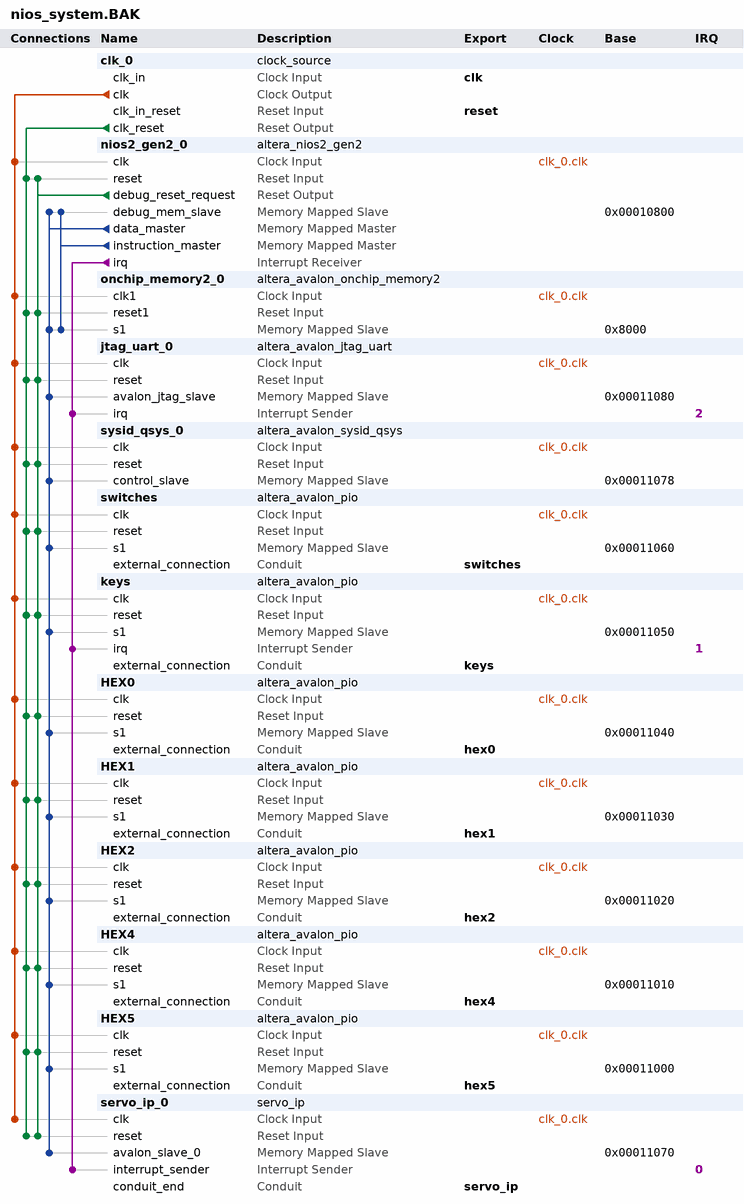
[diagram p0: system contents]
# Platform Designer (Qsys) system nios_system.BAK, Cyclone V 5CSEMA5F31C6
# Parameters at their usual value, and those the tool derives, are not listed.
package require -exact qsys 18.1
create_system nios_system.BAK
set_project_property DEVICE_FAMILY {Cyclone V}
set_project_property DEVICE 5CSEMA5F31C6

add_instance clk_0 clock_source 18.1
set_instance_parameter_value clk_0 clockFrequency 50000000

add_instance nios2_gen2_0 altera_nios2_gen2 18.1
set_instance_parameter_value nios2_gen2_0 dcache_size 2048
set_instance_parameter_value nios2_gen2_0 exceptionSlave onchip_memory2_0.s1
set_instance_parameter_value nios2_gen2_0 icache_size 4096
set_instance_parameter_value nios2_gen2_0 impl Tiny
set_instance_parameter_value nios2_gen2_0 resetSlave onchip_memory2_0.s1

add_instance onchip_memory2_0 altera_avalon_onchip_memory2 18.1
set_instance_parameter_value onchip_memory2_0 dataWidth 32
set_instance_parameter_value onchip_memory2_0 dualPort false
set_instance_parameter_value onchip_memory2_0 initMemContent true
set_instance_parameter_value onchip_memory2_0 initializationFileName onchip_mem.hex
set_instance_parameter_value onchip_memory2_0 memorySize 32768

add_instance jtag_uart_0 altera_avalon_jtag_uart 18.1
set_instance_parameter_value jtag_uart_0 simInteractiveOptions NO_INTERACTIVE_WINDOWS

add_instance sysid_qsys_0 altera_avalon_sysid_qsys 18.1
set_instance_parameter_value sysid_qsys_0 id 257

add_instance switches altera_avalon_pio 18.1
set_instance_parameter_value switches direction Input
set_instance_parameter_value switches width 8

add_instance keys altera_avalon_pio 18.1
set_instance_parameter_value keys captureEdge true
set_instance_parameter_value keys direction Input
set_instance_parameter_value keys edgeType FALLING
set_instance_parameter_value keys generateIRQ true
set_instance_parameter_value keys irqType EDGE
set_instance_parameter_value keys width 4

add_instance HEX0 altera_avalon_pio 18.1
set_instance_parameter_value HEX0 direction Output
set_instance_parameter_value HEX0 width 7

add_instance HEX1 altera_avalon_pio 18.1
set_instance_parameter_value HEX1 direction Output
set_instance_parameter_value HEX1 width 7

add_instance HEX2 altera_avalon_pio 18.1
set_instance_parameter_value HEX2 direction Output
set_instance_parameter_value HEX2 width 7

add_instance HEX4 altera_avalon_pio 18.1
set_instance_parameter_value HEX4 direction Output
set_instance_parameter_value HEX4 width 7

add_instance HEX5 altera_avalon_pio 18.1
set_instance_parameter_value HEX5 direction Output
set_instance_parameter_value HEX5 width 7

add_instance servo_ip_0 servo_ip 1.0
set_instance_parameter_value servo_ip_0 max_angle 00000000000000011000011010100000
set_instance_parameter_value servo_ip_0 min_angle 00000000000000001100001101010000

# connections
add_connection clk_0.clk HEX0.clk clock
add_connection clk_0.clk HEX1.clk clock
add_connection clk_0.clk HEX2.clk clock
add_connection clk_0.clk HEX4.clk clock
add_connection clk_0.clk HEX5.clk clock
add_connection clk_0.clk jtag_uart_0.clk clock
add_connection clk_0.clk keys.clk clock
add_connection clk_0.clk nios2_gen2_0.clk clock
add_connection clk_0.clk onchip_memory2_0.clk1 clock
add_connection clk_0.clk servo_ip_0.clk clock
add_connection clk_0.clk switches.clk clock
add_connection clk_0.clk sysid_qsys_0.clk clock
add_connection clk_0.clk_reset HEX0.reset reset
add_connection clk_0.clk_reset HEX1.reset reset
add_connection clk_0.clk_reset HEX2.reset reset
add_connection clk_0.clk_reset HEX4.reset reset
add_connection clk_0.clk_reset HEX5.reset reset
add_connection clk_0.clk_reset jtag_uart_0.reset reset
add_connection clk_0.clk_reset keys.reset reset
add_connection clk_0.clk_reset nios2_gen2_0.reset reset
add_connection clk_0.clk_reset onchip_memory2_0.reset1 reset
add_connection clk_0.clk_reset servo_ip_0.reset reset
add_connection clk_0.clk_reset switches.reset reset
add_connection clk_0.clk_reset sysid_qsys_0.reset reset
add_connection nios2_gen2_0.debug_reset_request HEX0.reset reset
add_connection nios2_gen2_0.debug_reset_request HEX1.reset reset
add_connection nios2_gen2_0.debug_reset_request HEX2.reset reset
add_connection nios2_gen2_0.debug_reset_request HEX4.reset reset
add_connection nios2_gen2_0.debug_reset_request HEX5.reset reset
add_connection nios2_gen2_0.debug_reset_request jtag_uart_0.reset reset
add_connection nios2_gen2_0.debug_reset_request keys.reset reset
add_connection nios2_gen2_0.debug_reset_request nios2_gen2_0.reset reset
add_connection nios2_gen2_0.debug_reset_request onchip_memory2_0.reset1 reset
add_connection nios2_gen2_0.debug_reset_request servo_ip_0.reset reset
add_connection nios2_gen2_0.debug_reset_request switches.reset reset
add_connection nios2_gen2_0.debug_reset_request sysid_qsys_0.reset reset
add_connection nios2_gen2_0.data_master HEX0.s1 avalon
set_connection_parameter_value nios2_gen2_0.data_master/HEX0.s1 baseAddress 0x00011040
add_connection nios2_gen2_0.data_master HEX1.s1 avalon
set_connection_parameter_value nios2_gen2_0.data_master/HEX1.s1 baseAddress 0x00011030
add_connection nios2_gen2_0.data_master HEX2.s1 avalon
set_connection_parameter_value nios2_gen2_0.data_master/HEX2.s1 baseAddress 0x00011020
add_connection nios2_gen2_0.data_master HEX4.s1 avalon
set_connection_parameter_value nios2_gen2_0.data_master/HEX4.s1 baseAddress 0x00011010
add_connection nios2_gen2_0.data_master HEX5.s1 avalon
set_connection_parameter_value nios2_gen2_0.data_master/HEX5.s1 baseAddress 0x00011000
add_connection nios2_gen2_0.data_master jtag_uart_0.avalon_jtag_slave avalon
set_connection_parameter_value nios2_gen2_0.data_master/jtag_uart_0.avalon_jtag_slave baseAddress 0x00011080
add_connection nios2_gen2_0.data_master keys.s1 avalon
set_connection_parameter_value nios2_gen2_0.data_master/keys.s1 baseAddress 0x00011050
add_connection nios2_gen2_0.data_master nios2_gen2_0.debug_mem_slave avalon
set_connection_parameter_value nios2_gen2_0.data_master/nios2_gen2_0.debug_mem_slave baseAddress 0x00010800
add_connection nios2_gen2_0.data_master onchip_memory2_0.s1 avalon
set_connection_parameter_value nios2_gen2_0.data_master/onchip_memory2_0.s1 baseAddress 0x8000
add_connection nios2_gen2_0.data_master servo_ip_0.avalon_slave_0 avalon
set_connection_parameter_value nios2_gen2_0.data_master/servo_ip_0.avalon_slave_0 baseAddress 0x00011070
add_connection nios2_gen2_0.data_master switches.s1 avalon
set_connection_parameter_value nios2_gen2_0.data_master/switches.s1 baseAddress 0x00011060
add_connection nios2_gen2_0.data_master sysid_qsys_0.control_slave avalon
set_connection_parameter_value nios2_gen2_0.data_master/sysid_qsys_0.control_slave baseAddress 0x00011078
add_connection nios2_gen2_0.instruction_master nios2_gen2_0.debug_mem_slave avalon
set_connection_parameter_value nios2_gen2_0.instruction_master/nios2_gen2_0.debug_mem_slave baseAddress 0x00010800
add_connection nios2_gen2_0.instruction_master onchip_memory2_0.s1 avalon
set_connection_parameter_value nios2_gen2_0.instruction_master/onchip_memory2_0.s1 baseAddress 0x8000
add_connection nios2_gen2_0.irq jtag_uart_0.irq interrupt
set_connection_parameter_value nios2_gen2_0.irq/jtag_uart_0.irq irqNumber 2
add_connection nios2_gen2_0.irq keys.irq interrupt
set_connection_parameter_value nios2_gen2_0.irq/keys.irq irqNumber 1
add_connection nios2_gen2_0.irq servo_ip_0.interrupt_sender interrupt
set_connection_parameter_value nios2_gen2_0.irq/servo_ip_0.interrupt_sender irqNumber 0

# exported interfaces
add_interface clk clock sink
set_interface_property clk EXPORT_OF clk_0.clk_in
add_interface hex0 conduit end
set_interface_property hex0 EXPORT_OF HEX0.external_connection
add_interface hex1 conduit end
set_interface_property hex1 EXPORT_OF HEX1.external_connection
add_interface hex2 conduit end
set_interface_property hex2 EXPORT_OF HEX2.external_connection
add_interface hex4 conduit end
set_interface_property hex4 EXPORT_OF HEX4.external_connection
add_interface hex5 conduit end
set_interface_property hex5 EXPORT_OF HEX5.external_connection
add_interface keys conduit end
set_interface_property keys EXPORT_OF keys.external_connection
add_interface reset reset sink
set_interface_property reset EXPORT_OF clk_0.clk_in_reset
add_interface servo_ip conduit end
set_interface_property servo_ip EXPORT_OF servo_ip_0.conduit_end
add_interface switches conduit end
set_interface_property switches EXPORT_OF switches.external_connection

set_interconnect_requirement {$system} qsys_mm.clockCrossingAdapter HANDSHAKE
set_interconnect_requirement {$system} qsys_mm.enableEccProtection FALSE
set_interconnect_requirement {$system} qsys_mm.insertDefaultSlave FALSE
set_interconnect_requirement {$system} qsys_mm.maxAdditionalLatency 1

save_system nios_system.BAK.qsys
